# Altium schematic sheet ETHERNET.SchDoc
size A4; SheetNumber: 3; SheetTotal: 6
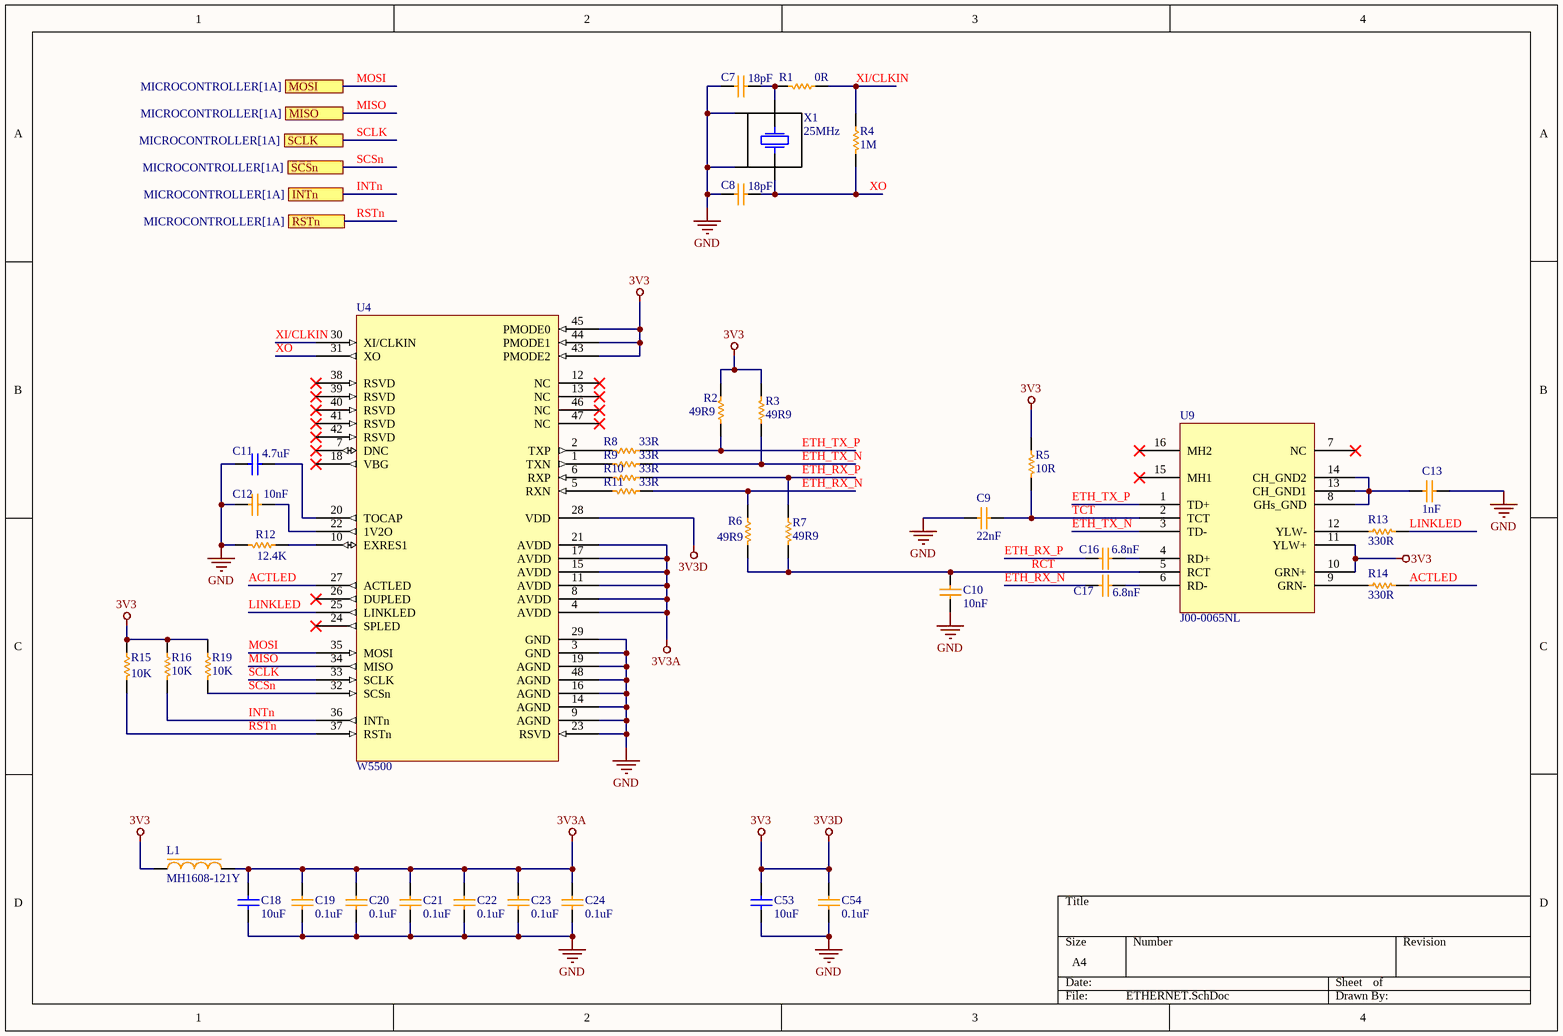
[diagram p0: ETHERNET.SchDoc]

## Parts
C7  18pF  [CAP-0603]
C8  18pF  [CAP-0603]
C9  22nF  [CAP-0603]
C10  10nF  [CAP-0603]
C11  4.7uF  [CAP-0805]
C12  10nF  [CAP-0603]
C13  1nF  [CAP-0603]
C16  6.8nF  [CAP-0603]
C17  6.8nF  [CAP-0603]
C18  10uF  [CAP-0805]
C19  0.1uF  [CAP-0603]
C20  0.1uF  [CAP-0603]
C21  0.1uF  [CAP-0603]
C22  0.1uF  [CAP-0603]
C23  0.1uF  [CAP-0603]
C24  0.1uF  [CAP-0603]
C53  10uF  [CAP-0805]
C54  0.1uF  [CAP-0603]
L1  MH1608-121Y  [FB-0603]
R1  0R  [RES-0603]
R2  49R9  [RES-0603]
R3  49R9  [RES-0603]
R4  1M  [RES-0603]
R5  10R  [RES-0603]
R6  49R9  [RES-0603]
R7  49R9  [RES-0603]
R8  33R  [RES-0603]
R9  33R  [RES-0603]
R10  33R  [RES-0603]
R11  33R  [RES-0603]
R12  12.4K  [RES-0603]
R13  330R  [RES-0603]
R14  330R  [RES-0603]
R15  10K  [RES-0603]
R16  10K  [RES-0603]
R19  10K  [RES-0603]
U4  W5500  [48LQFP]
U9  J00-0065NL  [J00-0065NL]
X1  25MHz  [CRYSTAL-2520]

## Ports
INTn (see MICROCONTROLLER[1A]), MISO (see MICROCONTROLLER[1A]), MOSI (see MICROCONTROLLER[1A]), RSTn (see MICROCONTROLLER[1A]), SCLK (see MICROCONTROLLER[1A]), SCSn (see MICROCONTROLLER[1A])

## Nets
3V3: C53.2 C54.2 L1.1 R2.1 R3.1 R5.2 R15.2 R16.2 R19.2 U4.28(VDD) U4.43(PMODE2) U4.44(PMODE1) U4.45(PMODE0) U9.10(GRN+) U9.11(YLW+)  [also labelled 3V3D]
3V3A: C18.2 C19.2 C20.2 C21.2 C22.2 C23.2 C24.2 L1.2 U4.4(AVDD) U4.8(AVDD) U4.11(AVDD) U4.15(AVDD) U4.17(AVDD) U4.21(AVDD)
GND: C7.1 C8.1 C9.2 C10.1 C11.1 C12.2 C13.2 C18.1 C19.1 C20.1 C21.1 C22.1 C23.1 C24.1 C53.1 C54.1 R12.1 U4.3(GND) U4.9(AGND) U4.14(AGND) U4.16(AGND) U4.19(AGND) U4.23(RSVD) U4.29(GND) U4.48(AGND) X1.2 X1.4
ACTLED: R14.1 U4.27(ACTLED)
ETH_RX_N: C17.1 R6.2 R11.2
ETH_RX_P: C16.1 R7.2 R10.2
ETH_TX_N: R3.2 R9.2 U9.3(TD-)
ETH_TX_P: R2.2 R8.2 U9.1(TD+)
INTn: R16.1 U4.36(INTn) ; port INTn
LINKLED: R13.1 U4.25(LINKLED)
MISO: U4.34(MISO) ; port MISO
MOSI: U4.35(MOSI) ; port MOSI
RCT: C10.2 R6.1 R7.1 U9.5(RCT)
RSTn: R15.1 U4.37(RSTn) ; port RSTn
SCLK: U4.33(SCLK) ; port SCLK
SCSn: R19.1 U4.32(SCSn) ; port SCSn
TCT: C9.1 R5.1 U9.2(TCT)
XI/CLKIN: R1.2 R4.2 U4.30(XI/CLKIN)
XO: C8.2 R4.1 U4.31(XO) X1.3
NetC7_2: C7.2 R1.1 X1.1
NetC11_2: C11.2 U4.20(TOCAP)
NetC12_1: C12.1 U4.22(1V2O)
NetC13_1: C13.1 U9.8(GHs_GND) U9.13(CH_GND1) U9.14(CH_GND2)
NetC16_2: C16.2 U9.4(RD+)
NetC17_2: C17.2 U9.6(RD-)
NetR8_1: R8.1 U4.2(TXP)
NetR9_1: R9.1 U4.1(TXN)
NetR10_1: R10.1 U4.6(RXP)
NetR11_1: R11.1 U4.5(RXN)
NetR12_2: R12.2 U4.10(EXRES1)
NetR13_2: R13.2 U9.12(YLW-)
NetR14_2: R14.2 U9.9(GRN-)

Not connected (* = marked no-connect by the designer): U4 7(DNC)* 12(NC)* 13(NC)* 18(VBG)* 24(SPLED)* 26(DUPLED)* 38(RSVD)* 39(RSVD)* 40(RSVD)* 41(RSVD)* 42(RSVD)* 46(NC)* 47(NC)*; U9 7(NC)* 15(MH1)* 16(MH2)*

## Library data of the parts
C7 C8 = CAP-0603: CAP CER 18PF 50V C0G/NP0 0603
C9 = CAP-0603: CAP CER 22NF 50V X7R 0603
C10 C12 = CAP-0603: CAP CER 1ONF 50V X7R 0603
C11 = CAP-0805: CAP CER 4.7UF 16V X7R 0805
C13 = CAP-0603: CAP CER 1NF 2000V X7R 0603
C16 C17 = CAP-0603: CAP CER 6800PF 50V X7R 0603
C18 C53 = CAP-0805: CAP CER 10UF 16V X5R 0805
C19-C24 C54 = CAP-0603: CAP CER 0.1UF 50V X7R 0603
L1 = FB-0603: FERRITE BEAD 120 OHM 0603 1LN
R1 = RES-0603: RES SMD 0 OHM JUMPER 1/10W 0603
R2 R3 R6 R7 = RES-0603: RES SMD 49.9 OHM 1% 1/10W 0603
R4 = RES-0603: RES SMD 1M OHM 1% 1/10W 0603
R5 = RES-0603: RES SMD 10 OHM 1% 1/10W 0603
R8-R11 = RES-0603: RES SMD 33 OHM 1% 1/10W 0603
R12 = RES-0603: RES SMD 12.4K OHM 1% 1/10W 0603
R13 R14 = RES-0603: RES SMD 330 OHM 5% 1/10W 0603
R15 R16 R19 = RES-0603: RES SMD 10K OHM 5% 1/10W 0603
U4 = W5500: IC CTLR 3-1 ETH TCP/IP 48LQFP
U9 = J00-0065NL: CONN JACK 1PORT PCB
X1 = CRYSTAL-2520: 122M4-25.000F13DWNJK / (2520,25MHz,13pF,10ppm,-40-105,30)